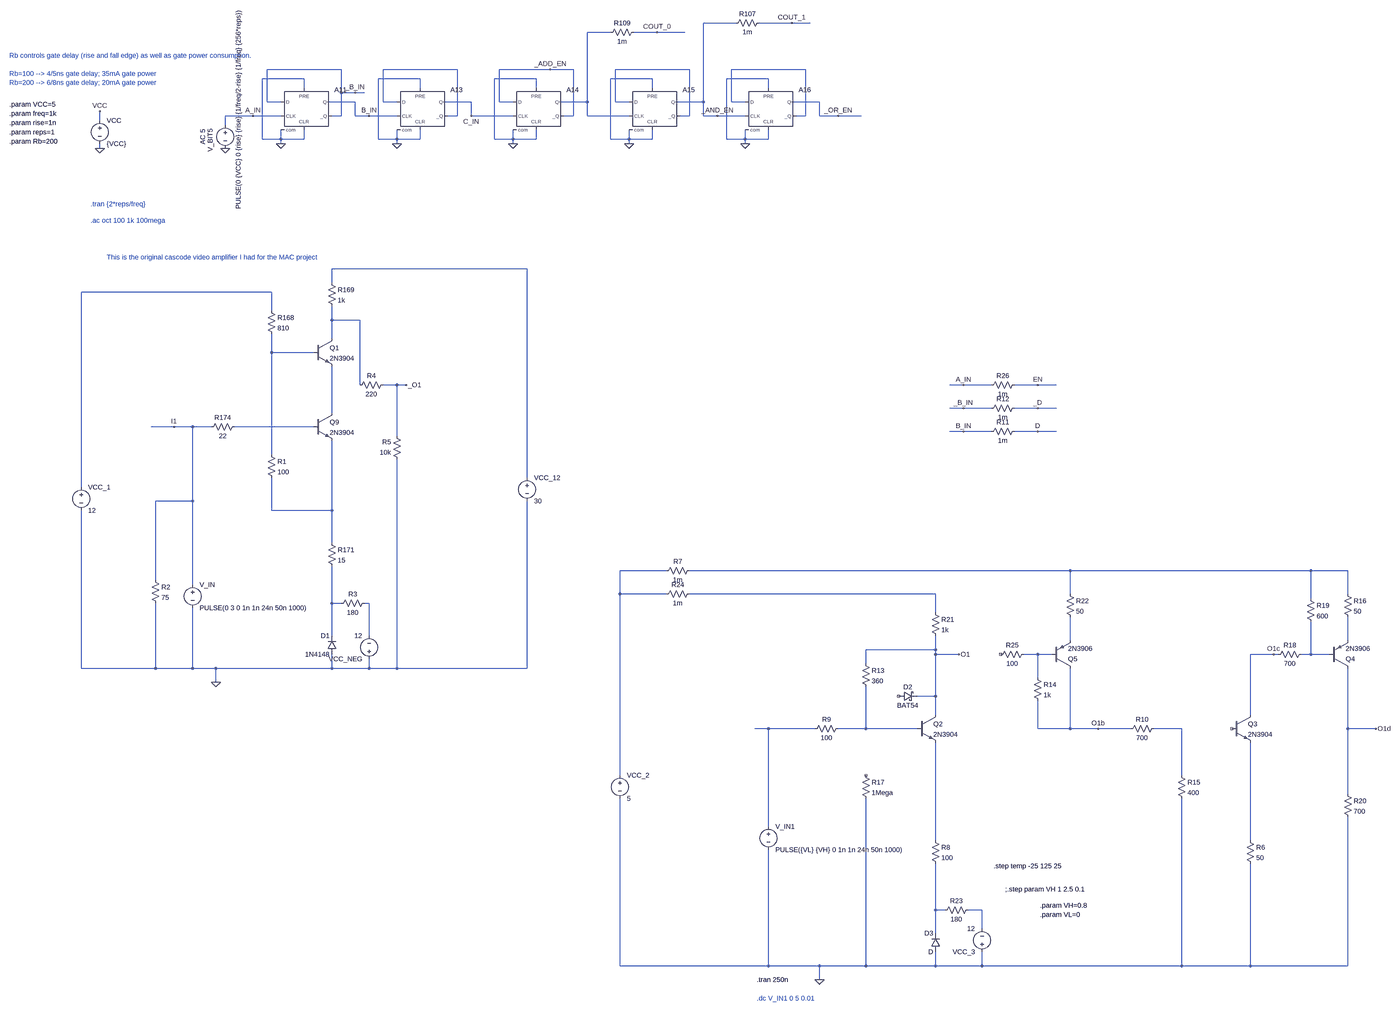
[diagram p0: schematic register_cascode.asc, whole sheet]
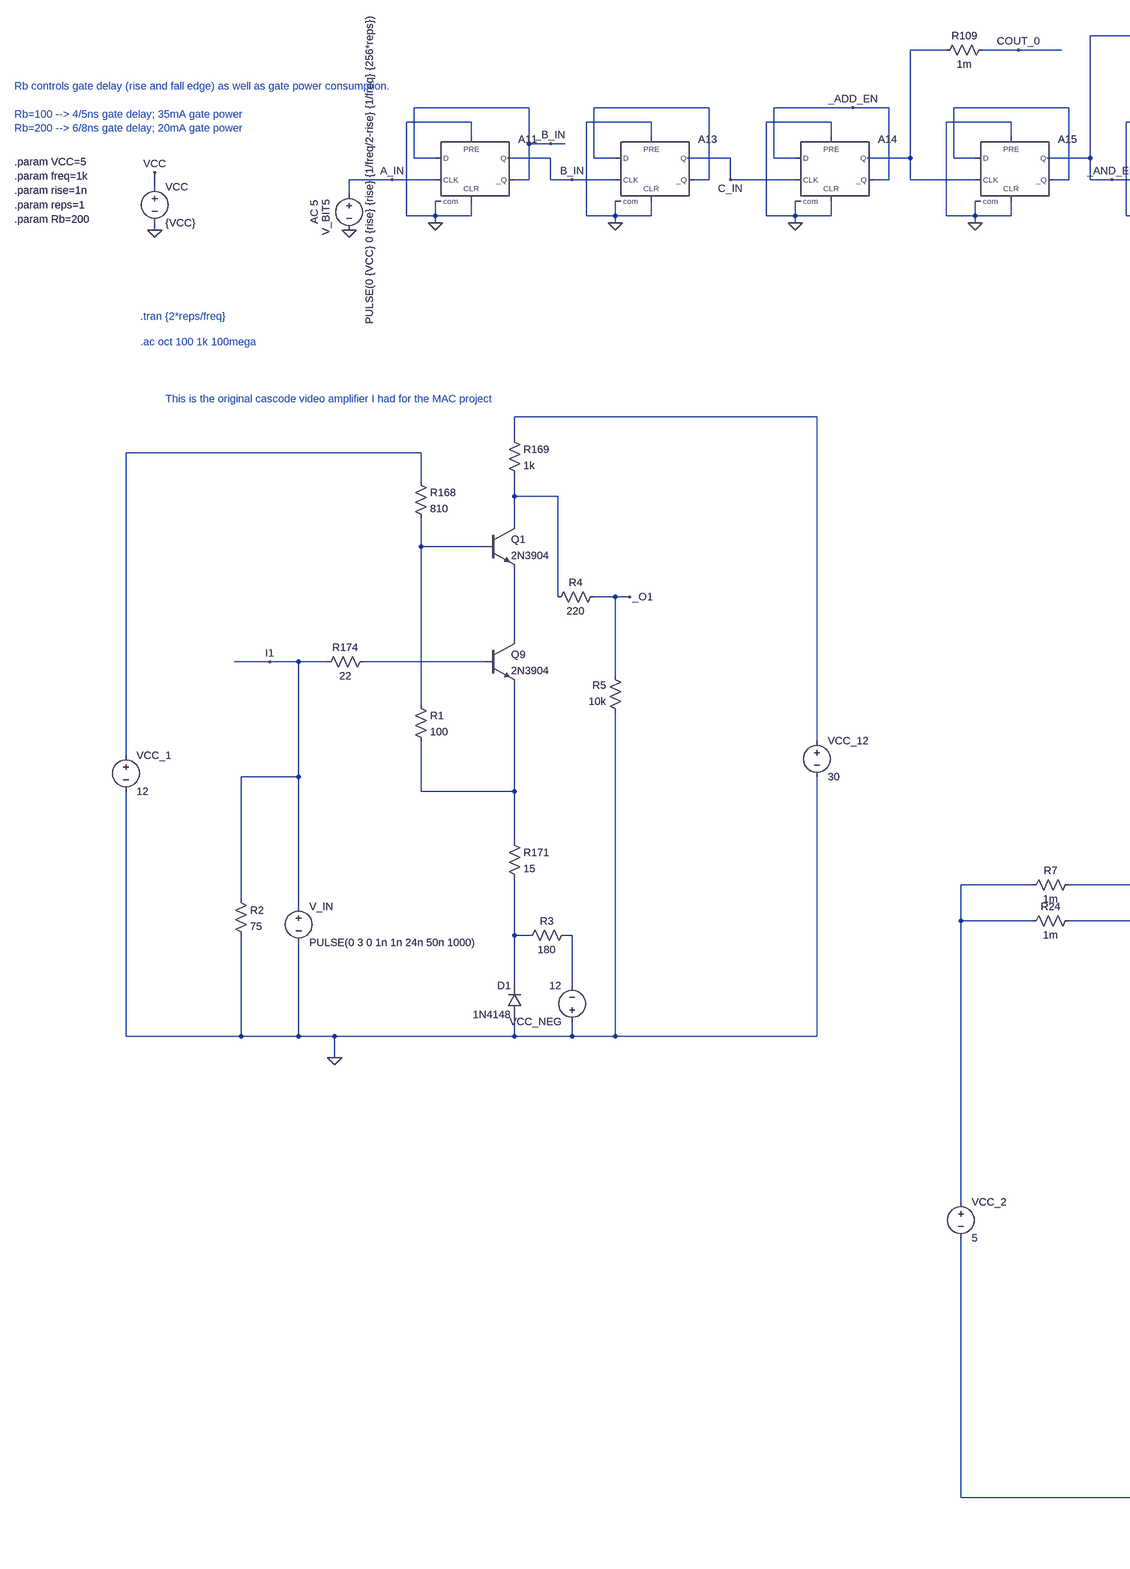
[diagram p1: schematic register_cascode.asc, part, row 1 of 1, column 1 of 2]
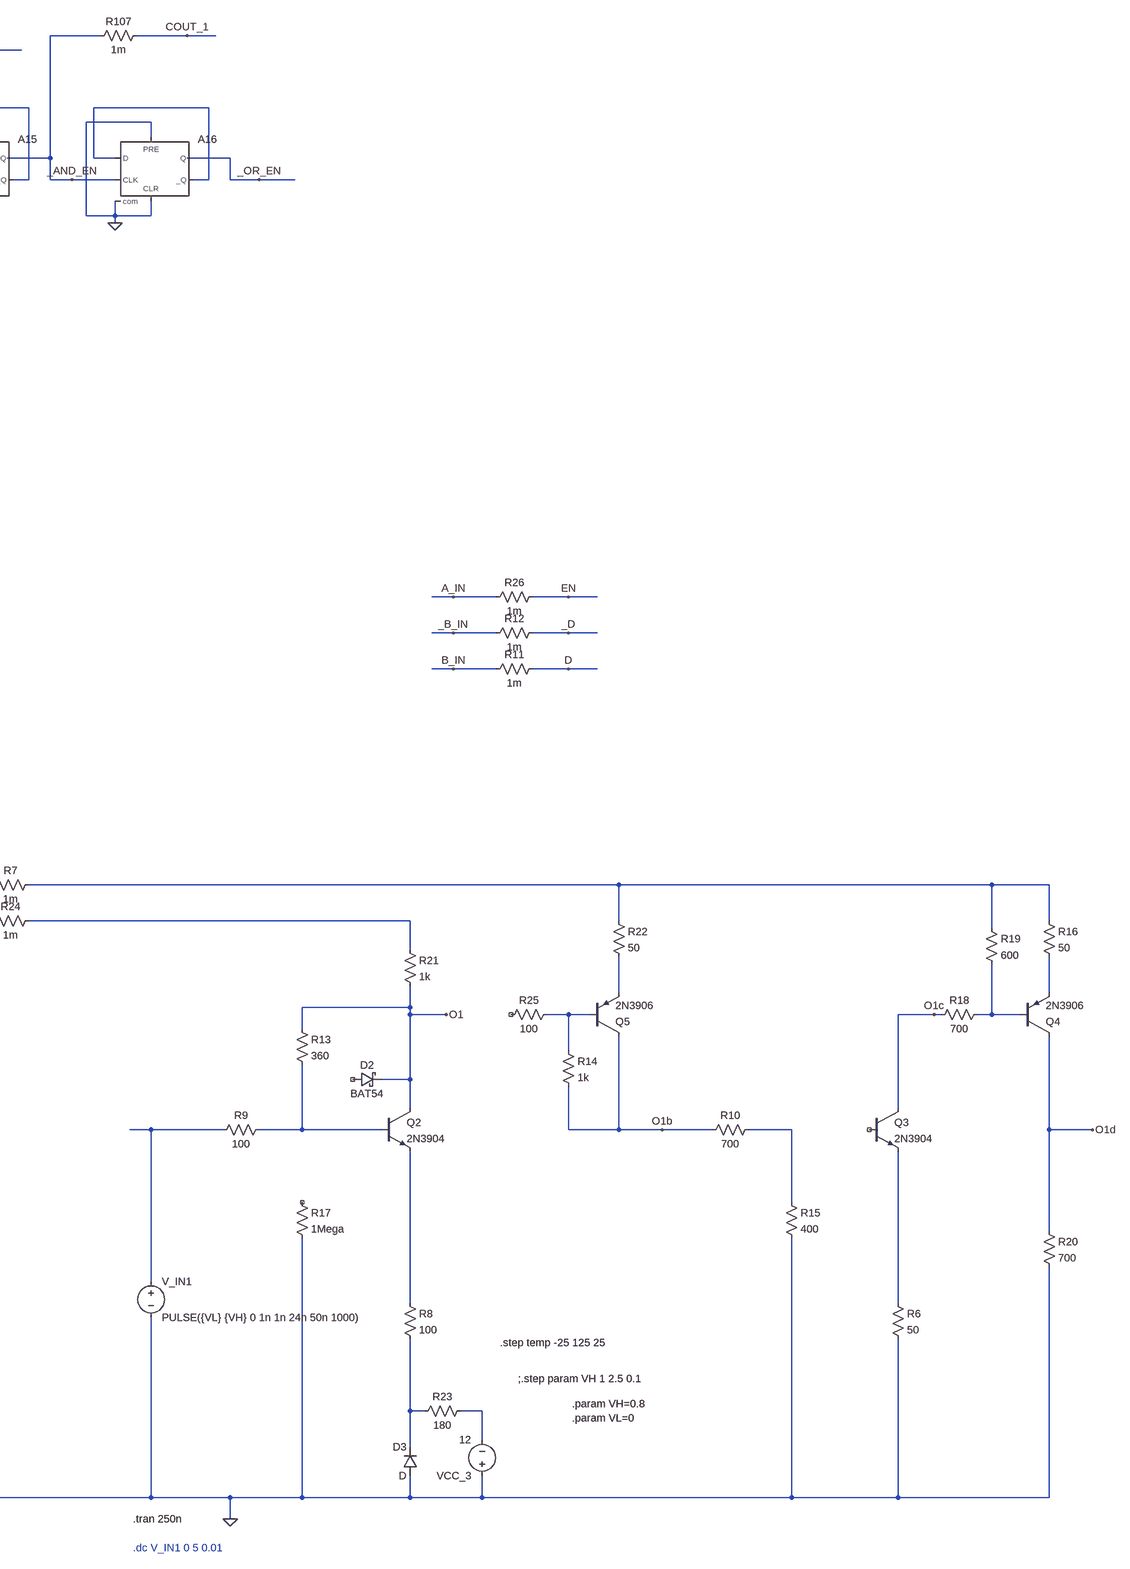
[diagram p2: schematic register_cascode.asc, part, row 1 of 1, column 2 of 2]
register_cascode.asc, the LTspice schematic file:
Version 4
SHEET 1 20052 9880
WIRE 1392 1344 1280 1344
WIRE 1584 1344 1472 1344
WIRE 1648 1344 1584 1344
WIRE 960 1376 880 1376
WIRE 1120 1376 1040 1376
WIRE 1216 1376 1120 1376
WIRE 32 1504 -224 1504
WIRE 432 1504 176 1504
WIRE 752 1504 576 1504
WIRE 832 1504 752 1504
WIRE 1232 1504 976 1504
WIRE 1632 1504 1376 1504
WIRE -96 1536 -240 1536
WIRE 304 1536 160 1536
WIRE 704 1536 560 1536
WIRE 1104 1536 960 1536
WIRE 1504 1536 1360 1536
WIRE -96 1568 -96 1536
WIRE 304 1568 304 1536
WIRE 704 1568 704 1536
WIRE 1104 1568 1104 1536
WIRE 1504 1568 1504 1536
WIRE 32 1584 32 1504
WIRE 80 1584 32 1584
WIRE 112 1584 80 1584
WIRE -224 1616 -224 1504
WIRE -176 1616 -224 1616
WIRE 80 1616 -16 1616
WIRE 176 1616 176 1504
WIRE 224 1616 176 1616
WIRE 480 1616 384 1616
WIRE 576 1616 576 1504
WIRE 624 1616 576 1616
WIRE 880 1616 880 1376
WIRE 880 1616 784 1616
WIRE 976 1616 976 1504
WIRE 1024 1616 976 1616
WIRE 1280 1616 1280 1344
WIRE 1280 1616 1184 1616
WIRE 1376 1616 1376 1504
WIRE 1424 1616 1376 1616
WIRE 1680 1616 1584 1616
WIRE -272 1664 -368 1664
WIRE -176 1664 -272 1664
WIRE 32 1664 32 1584
WIRE 32 1664 0 1664
WIRE 80 1664 80 1616
WIRE 128 1664 80 1664
WIRE 224 1664 128 1664
WIRE 432 1664 432 1504
WIRE 432 1664 400 1664
WIRE 480 1664 480 1616
WIRE 624 1664 480 1664
WIRE 832 1664 832 1504
WIRE 832 1664 800 1664
WIRE 880 1664 880 1616
WIRE 1024 1664 880 1664
WIRE 1232 1664 1232 1504
WIRE 1232 1664 1200 1664
WIRE 1280 1664 1280 1616
WIRE 1328 1664 1280 1664
WIRE 1424 1664 1328 1664
WIRE 1632 1664 1632 1504
WIRE 1632 1664 1600 1664
WIRE 1680 1664 1680 1616
WIRE 1744 1664 1680 1664
WIRE 1824 1664 1744 1664
WIRE -800 1680 -800 1648
WIRE -368 1696 -368 1664
WIRE -240 1744 -240 1536
WIRE -176 1744 -176 1712
WIRE -176 1744 -240 1744
WIRE -96 1744 -96 1712
WIRE -96 1744 -176 1744
WIRE 160 1744 160 1536
WIRE 224 1744 224 1712
WIRE 224 1744 160 1744
WIRE 304 1744 304 1712
WIRE 304 1744 224 1744
WIRE 560 1744 560 1536
WIRE 624 1744 624 1712
WIRE 624 1744 560 1744
WIRE 704 1744 704 1712
WIRE 704 1744 624 1744
WIRE 960 1744 960 1536
WIRE 1024 1744 1024 1712
WIRE 1024 1744 960 1744
WIRE 1104 1744 1104 1712
WIRE 1104 1744 1024 1744
WIRE 1360 1744 1360 1536
WIRE 1424 1744 1424 1712
WIRE 1424 1744 1360 1744
WIRE 1504 1744 1504 1712
WIRE 1504 1744 1424 1744
WIRE -176 1760 -176 1744
WIRE 224 1760 224 1744
WIRE 624 1760 624 1744
WIRE 1024 1760 1024 1744
WIRE 1424 1760 1424 1744
WIRE -800 1776 -800 1760
WIRE 672 2208 0 2208
WIRE 0 2256 0 2208
WIRE -208 2288 -864 2288
WIRE -208 2352 -208 2288
WIRE 0 2384 0 2336
WIRE 96 2384 0 2384
WIRE 0 2448 0 2384
WIRE -208 2496 -208 2432
WIRE -64 2496 -208 2496
WIRE 96 2608 96 2384
WIRE 224 2608 176 2608
WIRE 256 2608 224 2608
WIRE 2176 2608 2128 2608
WIRE 2272 2608 2176 2608
WIRE 2432 2608 2352 2608
WIRE 2496 2608 2432 2608
WIRE 2176 2688 2128 2688
WIRE 2272 2688 2176 2688
WIRE 2432 2688 2352 2688
WIRE 2496 2688 2432 2688
WIRE 0 2704 0 2544
WIRE -544 2752 -624 2752
WIRE -480 2752 -544 2752
WIRE -416 2752 -480 2752
WIRE -64 2752 -336 2752
WIRE 2176 2768 2128 2768
WIRE 2272 2768 2176 2768
WIRE 2432 2768 2352 2768
WIRE 2496 2768 2432 2768
WIRE 224 2784 224 2608
WIRE -208 2848 -208 2496
WIRE 672 2928 672 2208
WIRE -864 2960 -864 2288
WIRE -480 3008 -480 2752
WIRE -480 3008 -608 3008
WIRE -208 3040 -208 2928
WIRE 0 3040 0 2800
WIRE 0 3040 -208 3040
WIRE 0 3152 0 3040
WIRE 1152 3248 992 3248
WIRE 2544 3248 1232 3248
WIRE 3376 3248 2544 3248
WIRE 3504 3248 3376 3248
WIRE -608 3280 -608 3008
WIRE -480 3296 -480 3008
WIRE 992 3328 992 3248
WIRE 1152 3328 992 3328
WIRE 2080 3328 1232 3328
WIRE 2544 3328 2544 3248
WIRE 3504 3328 3504 3248
WIRE 3376 3344 3376 3248
WIRE 0 3360 0 3232
WIRE 32 3360 0 3360
WIRE 128 3360 112 3360
WIRE 2080 3392 2080 3328
WIRE 0 3472 0 3360
WIRE 128 3472 128 3360
WIRE 2544 3488 2544 3408
WIRE 3504 3488 3504 3408
WIRE 2080 3520 2080 3472
WIRE 2080 3520 1840 3520
WIRE 2080 3536 2080 3520
WIRE 2160 3536 2080 3536
WIRE 2432 3536 2384 3536
WIRE 2480 3536 2432 3536
WIRE 3248 3536 3168 3536
WIRE 3264 3536 3248 3536
WIRE 3376 3536 3376 3424
WIRE 3376 3536 3344 3536
WIRE 3440 3536 3376 3536
WIRE 1840 3568 1840 3520
WIRE -864 3584 -864 3040
WIRE -608 3584 -608 3360
WIRE -608 3584 -864 3584
WIRE -480 3584 -480 3376
WIRE -480 3584 -608 3584
WIRE -400 3584 -480 3584
WIRE 0 3584 0 3536
WIRE 0 3584 -400 3584
WIRE 128 3584 128 3552
WIRE 128 3584 0 3584
WIRE 224 3584 224 2864
WIRE 224 3584 128 3584
WIRE 672 3584 672 3008
WIRE 672 3584 224 3584
WIRE 2432 3616 2432 3536
WIRE -400 3632 -400 3584
WIRE 2080 3680 2080 3536
WIRE 2080 3680 2016 3680
WIRE 2080 3744 2080 3680
WIRE 3168 3744 3168 3536
WIRE 1504 3792 1456 3792
WIRE 1664 3792 1504 3792
WIRE 1840 3792 1840 3648
WIRE 1840 3792 1744 3792
WIRE 2016 3792 1840 3792
WIRE 2432 3792 2432 3696
WIRE 2544 3792 2544 3584
WIRE 2544 3792 2432 3792
WIRE 2640 3792 2544 3792
WIRE 2752 3792 2640 3792
WIRE 2928 3792 2832 3792
WIRE 3504 3792 3504 3584
WIRE 3600 3792 3504 3792
WIRE 992 3968 992 3328
WIRE 2928 3968 2928 3792
WIRE 3504 4032 3504 3792
WIRE 1504 4144 1504 3792
WIRE 2080 4192 2080 3840
WIRE 3168 4192 3168 3840
WIRE 2080 4432 2080 4272
WIRE 2112 4432 2080 4432
WIRE 2240 4432 2192 4432
WIRE 2240 4496 2240 4432
WIRE 2080 4512 2080 4432
WIRE 992 4624 992 4048
WIRE 1504 4624 1504 4224
WIRE 1504 4624 992 4624
WIRE 1680 4624 1504 4624
WIRE 1840 4624 1840 4048
WIRE 1840 4624 1680 4624
WIRE 2080 4624 2080 4576
WIRE 2080 4624 1840 4624
WIRE 2240 4624 2240 4576
WIRE 2240 4624 2080 4624
WIRE 2928 4624 2928 4048
WIRE 2928 4624 2240 4624
WIRE 3168 4624 3168 4272
WIRE 3168 4624 2928 4624
WIRE 3504 4624 3504 4112
WIRE 3504 4624 3168 4624
WIRE 1680 4672 1680 4624
FLAG -800 1776 0
FLAG -800 1648 VCC
FLAG -400 3632 0
FLAG -176 1760 0
FLAG -368 1776 0
FLAG -272 1664 A_IN
FLAG 128 1664 B_IN
FLAG 224 1760 0
FLAG 480 1664 C_IN
FLAG 624 1760 0
FLAG 752 1504 _ADD_EN
FLAG 1024 1760 0
FLAG 1328 1664 _AND_EN
FLAG 1424 1760 0
FLAG 1744 1664 _OR_EN
FLAG 1120 1376 COUT_0
FLAG 1584 1344 COUT_1
FLAG 80 1584 _B_IN
FLAG 2432 2608 EN
FLAG 2432 2688 _D
FLAG 2432 2768 D
FLAG 2176 2608 A_IN
FLAG 2176 2688 _B_IN
FLAG 2176 2768 B_IN
FLAG 256 2608 _O1
FLAG -544 2752 I1
FLAG 1680 4672 0
FLAG 2160 3536 O1
FLAG 2640 3792 O1b
FLAG 3248 3536 O1c
FLAG 3600 3792 O1d
SYMBOL voltage -800 1664 R0
WINDOW 123 0 0 Left 0
WINDOW 39 0 0 Left 0
SYMATTR InstName VCC
SYMATTR Value {VCC}
SYMBOL npn -64 2704 R0
SYMATTR InstName Q9
SYMATTR Value 2N3904
SYMBOL res -224 2336 R0
SYMATTR InstName R168
SYMATTR Value 810
SYMBOL res -16 2240 R0
SYMATTR InstName R169
SYMATTR Value 1k
SYMBOL res -16 3136 R0
SYMATTR InstName R171
SYMATTR Value 15
SYMBOL res -432 2768 R270
WINDOW 0 32 56 VTop 2
WINDOW 3 0 56 VBottom 2
SYMATTR InstName R174
SYMATTR Value 22
SYMBOL voltage -368 1680 R0
WINDOW 123 -77 30 VRight 2
WINDOW 39 0 0 Left 0
WINDOW 0 -51 28 VRight 2
WINDOW 3 46 -379 VRight 2
SYMATTR Value2 AC 5
SYMATTR InstName V_BIT5
SYMATTR Value PULSE(0 {VCC} 0 {rise} {rise} {1/freq/2-rise} {1/freq} {256*reps})
SYMBOL Digital\\dflop -96 1568 R0
SYMATTR SpiceLine Vhigh={VCC}
SYMATTR InstName A11
SYMBOL Digital\\dflop 304 1568 R0
SYMATTR SpiceLine Vhigh={VCC}
SYMATTR InstName A13
SYMBOL Digital\\dflop 1104 1568 R0
SYMATTR SpiceLine Vhigh={VCC}
SYMATTR InstName A15
SYMBOL Digital\\dflop 1504 1568 R0
SYMATTR SpiceLine Vhigh={VCC}
SYMATTR InstName A16
SYMBOL Digital\\dflop 704 1568 R0
SYMATTR SpiceLine Vhigh={VCC}
SYMATTR InstName A14
SYMBOL res 1488 1328 R90
WINDOW 0 0 56 VBottom 2
WINDOW 3 32 56 VTop 2
SYMATTR InstName R107
SYMATTR Value 1m
SYMBOL res 1056 1360 R90
WINDOW 0 0 56 VBottom 2
WINDOW 3 32 56 VTop 2
SYMATTR InstName R109
SYMATTR Value 1m
SYMBOL res 2256 2784 R270
WINDOW 0 32 56 VTop 2
WINDOW 3 0 56 VBottom 2
SYMATTR InstName R11
SYMATTR Value 1m
SYMBOL res 2256 2704 R270
WINDOW 0 32 56 VTop 2
WINDOW 3 0 56 VBottom 2
SYMATTR InstName R12
SYMATTR Value 1m
SYMBOL res 2256 2624 R270
WINDOW 0 32 56 VTop 2
WINDOW 3 0 56 VBottom 2
SYMATTR InstName R26
SYMATTR Value 1m
SYMBOL npn -64 2448 R0
SYMATTR InstName Q1
SYMATTR Value 2N3904
SYMBOL res -224 2832 R0
SYMATTR InstName R1
SYMATTR Value 100
SYMBOL diode 16 3536 R180
WINDOW 0 24 64 Left 2
WINDOW 3 24 0 Left 2
SYMATTR InstName D1
SYMATTR Value 1N4148
SYMBOL voltage 128 3568 R180
WINDOW 123 0 0 Left 0
WINDOW 39 0 0 Left 0
SYMATTR InstName VCC_NEG
SYMATTR Value 12
SYMBOL res 128 3344 R90
WINDOW 0 0 56 VBottom 2
WINDOW 3 32 56 VTop 2
SYMATTR InstName R3
SYMATTR Value 180
SYMBOL voltage 672 2912 R0
WINDOW 123 0 0 Left 0
WINDOW 39 0 0 Left 0
SYMATTR InstName VCC_12
SYMATTR Value 30
SYMBOL voltage -480 3280 R0
WINDOW 123 0 0 Left 0
WINDOW 39 0 0 Left 0
SYMATTR InstName V_IN
SYMATTR Value PULSE(0 3 0 1n 1n 24n 50n 1000)
SYMBOL voltage -864 2944 R0
WINDOW 123 0 0 Left 0
WINDOW 39 0 0 Left 0
SYMATTR InstName VCC_1
SYMATTR Value 12
SYMBOL res -624 3264 R0
SYMATTR InstName R2
SYMATTR Value 75
SYMBOL res 192 2592 R90
WINDOW 0 0 56 VBottom 2
WINDOW 3 32 56 VTop 2
SYMATTR InstName R4
SYMATTR Value 220
SYMBOL res 240 2880 R180
WINDOW 0 36 76 Left 2
WINDOW 3 36 40 Left 2
SYMATTR InstName R5
SYMATTR Value 10k
SYMBOL npn 2016 3744 R0
SYMATTR InstName Q2
SYMATTR Value 2N3904
SYMBOL res 2064 4176 R0
SYMATTR InstName R8
SYMATTR Value 100
SYMBOL res 1648 3808 R270
WINDOW 0 32 56 VTop 2
WINDOW 3 0 56 VBottom 2
SYMATTR InstName R9
SYMATTR Value 100
SYMBOL voltage 992 3952 R0
WINDOW 123 0 0 Left 0
WINDOW 39 0 0 Left 0
SYMATTR InstName VCC_2
SYMATTR Value 5
SYMBOL res 1248 3312 R90
WINDOW 0 0 56 VBottom 2
WINDOW 3 32 56 VTop 2
SYMATTR InstName R24
SYMATTR Value 1m
SYMBOL res 1248 3232 R90
WINDOW 0 0 56 VBottom 2
WINDOW 3 32 56 VTop 2
SYMATTR InstName R7
SYMATTR Value 1m
SYMBOL res 1824 3952 R0
SYMATTR InstName R17
SYMATTR Value 1Mega
SYMBOL voltage 1504 4128 R0
WINDOW 123 0 0 Left 0
WINDOW 39 0 0 Left 0
SYMATTR InstName V_IN1
SYMATTR Value PULSE({VL} {VH} 0 1n 1n 24n 50n 1000)
SYMBOL pnp 2480 3584 M180
SYMATTR InstName Q5
SYMATTR Value 2N3906
SYMBOL res 2528 3312 R0
SYMATTR InstName R22
SYMATTR Value 50
SYMBOL res 2288 3552 R270
WINDOW 0 32 56 VTop 2
WINDOW 3 0 56 VBottom 2
SYMATTR InstName R25
SYMATTR Value 100
SYMBOL npn 3104 3744 R0
SYMATTR InstName Q3
SYMATTR Value 2N3904
SYMBOL res 3152 4176 R0
SYMATTR InstName R6
SYMATTR Value 50
SYMBOL res 2736 3808 R270
WINDOW 0 32 56 VTop 2
WINDOW 3 0 56 VBottom 2
SYMATTR InstName R10
SYMATTR Value 700
SYMBOL res 2912 3952 R0
SYMATTR InstName R15
SYMATTR Value 400
SYMBOL pnp 3440 3584 M180
SYMATTR InstName Q4
SYMATTR Value 2N3906
SYMBOL res 3488 3312 R0
SYMATTR InstName R16
SYMATTR Value 50
SYMBOL res 3248 3552 R270
WINDOW 0 32 56 VTop 2
WINDOW 3 0 56 VBottom 2
SYMATTR InstName R18
SYMATTR Value 700
SYMBOL res 3360 3328 R0
SYMATTR InstName R19
SYMATTR Value 600
SYMBOL res 3488 4016 R0
SYMATTR InstName R20
SYMATTR Value 700
SYMBOL schottky 1952 3696 R270
WINDOW 0 32 32 VTop 2
WINDOW 3 0 32 VBottom 2
SYMATTR InstName D2
SYMATTR Value BAT54
SYMATTR Description Diode
SYMATTR Type diode
SYMBOL res 1824 3552 R0
SYMATTR InstName R13
SYMATTR Value 360
SYMBOL res 2416 3600 R0
SYMATTR InstName R14
SYMATTR Value 1k
SYMBOL res 2064 3376 R0
SYMATTR InstName R21
SYMATTR Value 1k
SYMBOL diode 2096 4576 R180
WINDOW 0 24 64 Left 2
WINDOW 3 24 0 Left 2
SYMATTR InstName D3
SYMBOL voltage 2240 4592 R180
WINDOW 123 0 0 Left 0
WINDOW 39 0 0 Left 0
SYMATTR InstName VCC_3
SYMATTR Value 12
SYMBOL res 2208 4416 R90
WINDOW 0 0 56 VBottom 2
WINDOW 3 32 56 VTop 2
SYMATTR InstName R23
SYMATTR Value 180
TEXT -832 1968 Left 2 ;.tran {2*reps/freq}
TEXT -832 2024 Left 2 ;.ac oct 100 1k 100mega
TEXT -1112 1624 Left 2 !.param VCC=5
TEXT -1112 1656 Left 2 !.param freq=1k
TEXT -1112 1688 Left 2 !.param rise=1n
TEXT -1112 1720 Left 2 !.param reps=1
TEXT -1112 1752 Left 2 !.param Rb=200
TEXT -1112 1456 Left 2 ;Rb controls gate delay (rise and fall edge) as well as gate power consumption.\n \nRb=100 --> 4/5ns gate delay; 35mA gate power\nRb=200 --> 6/8ns gate delay; 20mA gate power
TEXT -776 2168 Left 2 ;This is the original cascode video amplifier I had for the MAC project
TEXT 1464 4736 Left 2 ;.dc V_IN1 0 5 0.01
TEXT 1464 4672 Left 2 !.tran 250n
TEXT 2280 4280 Left 2 !.step temp -25 125 25
TEXT 2320 4360 Left 2 !;.step param VH 1 2.5 0.1
TEXT 2440 4416 Left 2 !.param VH=0.8
TEXT 2440 4448 Left 2 !.param VL=0

The netlist it stands for:
* register_cascode.asc
VCC VCC 0 {VCC}
Q9 N009 N010 N011 0 2N3904
R168 N006 N008 810
R169 N005 N007 1k
R171 N011 N015 15
R174 I1 N010 22
V_BIT5 A_IN 0 PULSE(0 {VCC} 0 {rise} {rise} {1/freq/2-rise} {1/freq} {256*reps}) AC 5
A11 _B_IN 0 A_IN 0 0 _B_IN B_IN 0 DFLOP Vhigh={VCC}
A13 N002 0 B_IN 0 0 N002 C_IN 0 DFLOP Vhigh={VCC}
A15 N003 0 N001 0 0 N003 _AND_EN 0 DFLOP Vhigh={VCC}
A16 N004 0 _AND_EN 0 0 N004 _OR_EN 0 DFLOP Vhigh={VCC}
A14 _ADD_EN 0 C_IN 0 0 _ADD_EN N001 0 DFLOP Vhigh={VCC}
R107 COUT_1 _AND_EN 1m
R109 COUT_0 N001 1m
R11 B_IN D 1m
R12 _B_IN _D 1m
R26 A_IN EN 1m
Q1 N007 N008 N009 0 2N3904
R1 N008 N011 100
D1 0 N015 1N4148
VCC_NEG 0 N016 12
R3 N016 N015 180
VCC_12 N005 0 30
V_IN I1 0 PULSE(0 3 0 1n 1n 24n 50n 1000)
VCC_1 N006 0 12
R2 I1 0 75
R4 _O1 N007 220
R5 0 _O1 10k
Q2 O1 N022 N024 0 2N3904
R8 N024 N026 100
R9 N021 N022 100
VCC_2 N012 0 5
R24 N014 N012 1m
R7 N013 N012 1m
R17 NC_01 0 1Mega
V_IN1 N021 0 PULSE({VL} {VH} 0 1n 1n 24n 50n 1000)
Q5 O1b N019 N017 0 2N3906
R22 N013 N017 50
R25 NC_02 N019 100
Q3 O1c NC_03 N025 0 2N3904
R6 N025 0 50
R10 O1b N023 700
R15 N023 0 400
Q4 O1d N020 N018 0 2N3906
R16 N013 N018 50
R18 O1c N020 700
R19 N013 N020 600
R20 O1d 0 700
D2 NC_04 O1 BAT54
R13 O1 N022 360
R14 N019 O1b 1k
R21 N014 O1 1k
D3 0 N026 D
VCC_3 0 N027 12
R23 N027 N026 180
.model D D
.lib standard.dio
.model NPN NPN
.model PNP PNP
.lib standard.bjt
* .tran {2*reps/freq}
* .ac oct 100 1k 100mega
.param VCC=5
.param freq=1k
.param rise=1n
.param reps=1
.param Rb=200
* Rb controls gate delay (rise and fall edge) as well as gate power consumption.
* Rb=100 --> 4/5ns gate delay; 35mA gate power
* Rb=200 --> 6/8ns gate delay; 20mA gate power
* This is the original cascode video amplifier I had for the MAC project
* .dc V_IN1 0 5 0.01
.tran 250n
.step temp -25 125 25
;.step param VH 1 2.5 0.1
.param VH=0.8
.param VL=0
.backanno
.end